# EAGLE design TSOC_MINIPROG_ADAPTER_R1_1 (EAGLE 6.6.0)
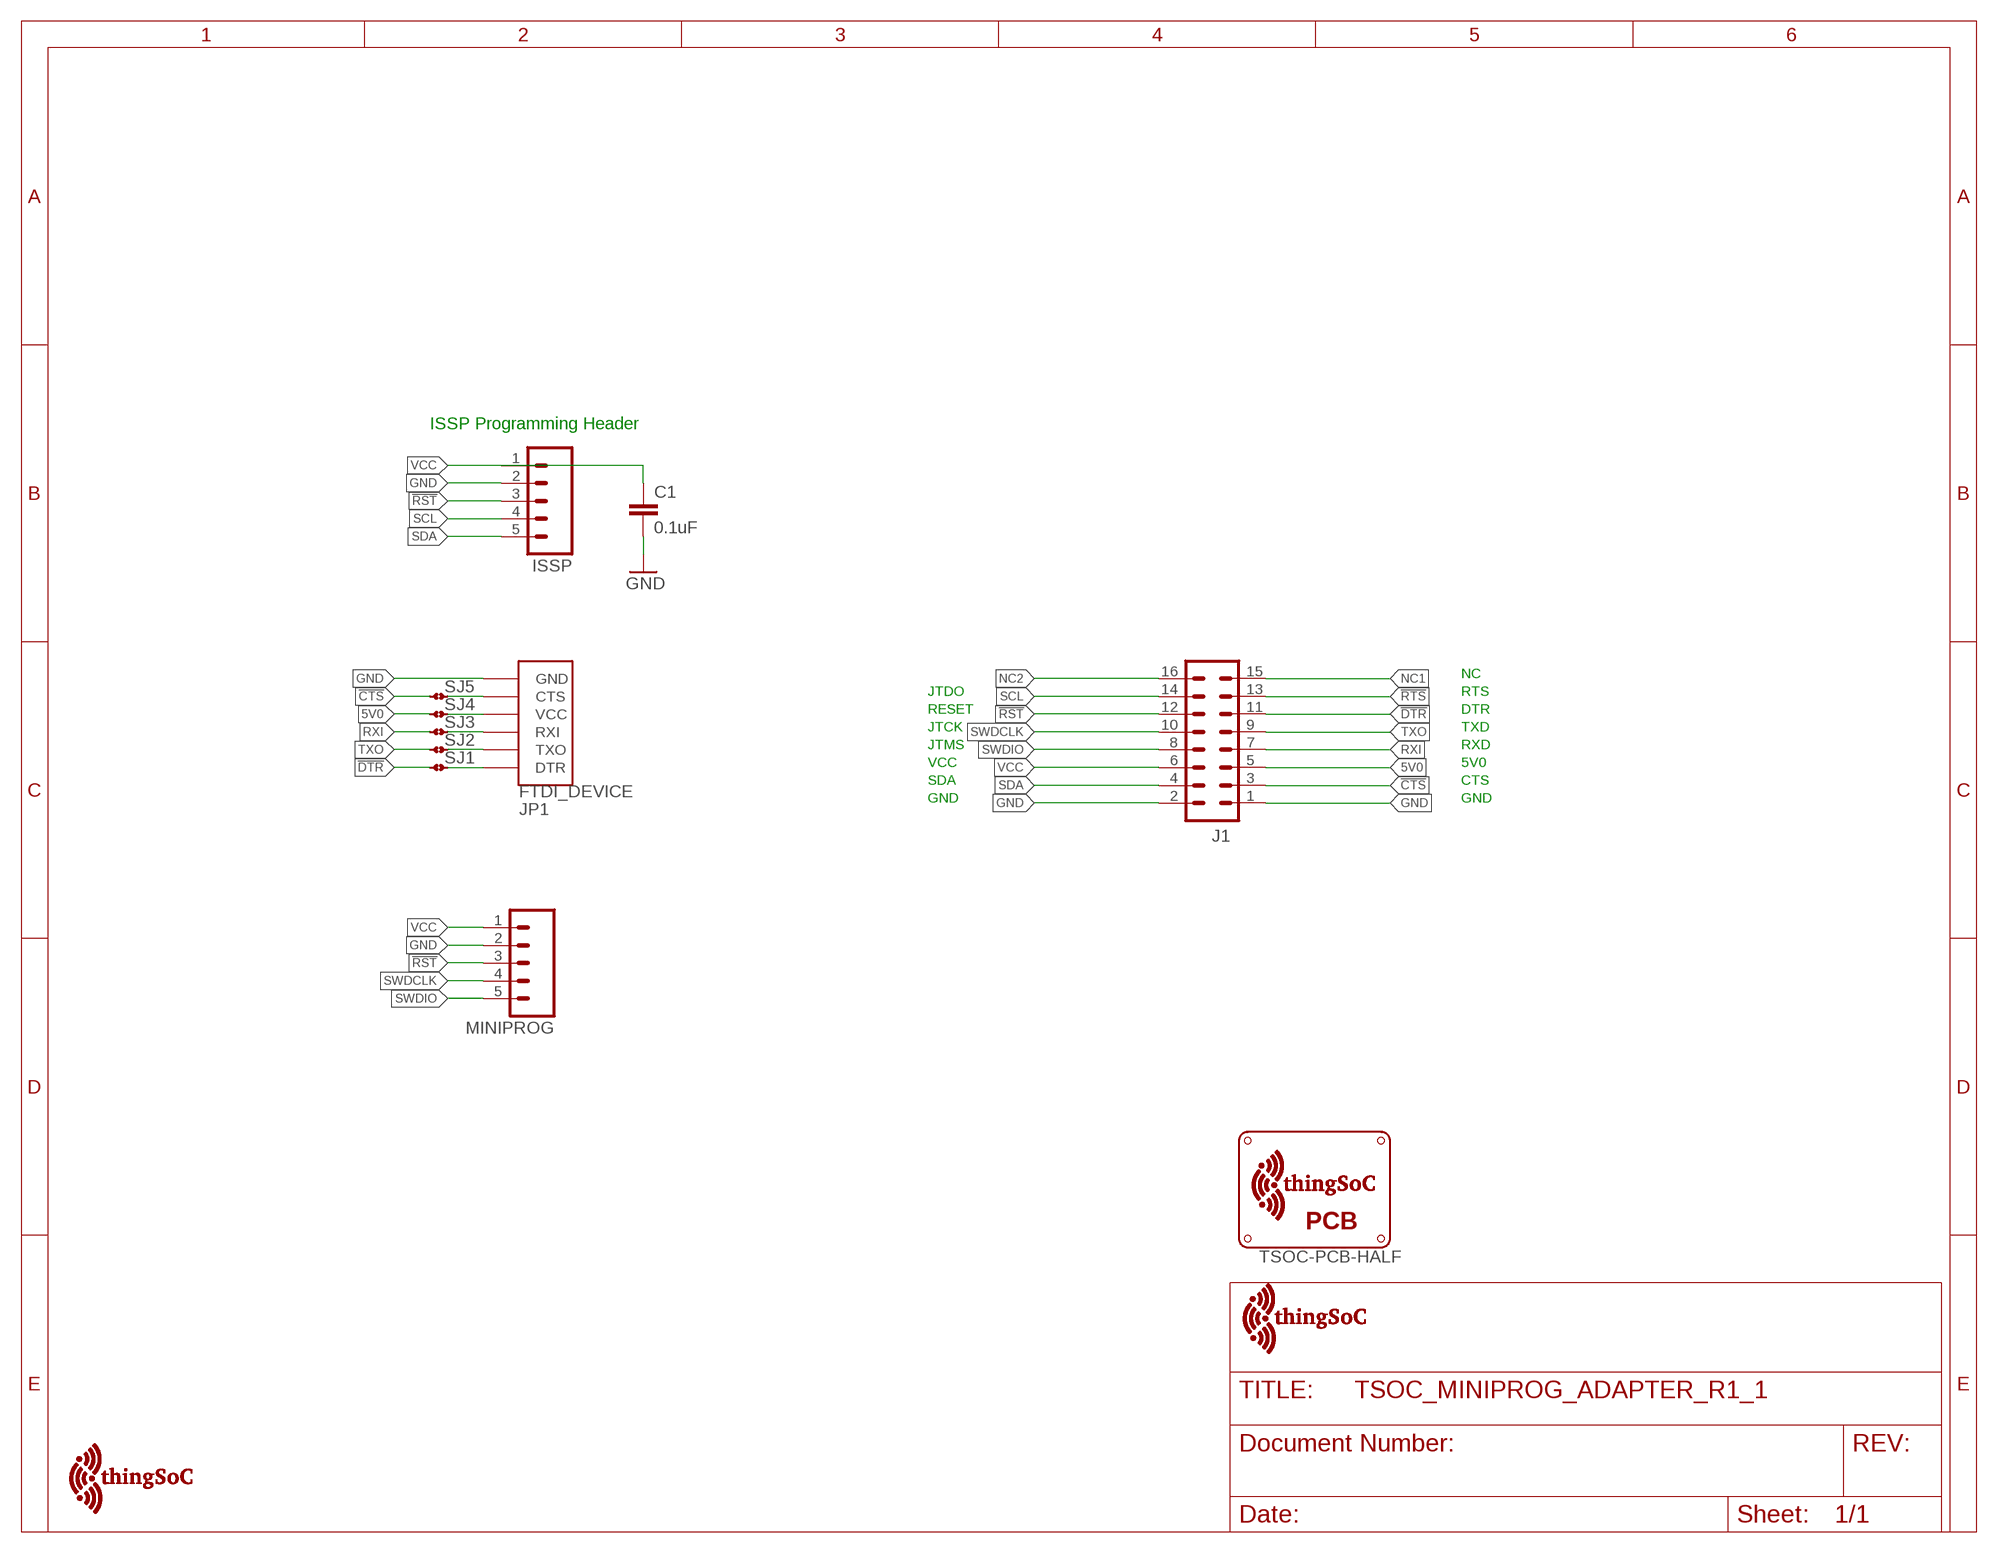
[diagram p0: schematic, sheet 1]

## Parts
C1  0.1uF  CAP0603-CAP  [0603-CAP]
ISSP  M05PTH  [1X05]
J1  M08X2  [2X8]
JP1  FTDI_DEVICE  [FTDI_DEVICE_SIDE]
MINIPROG  M05PTH  [1X05]
SJ1  JMP-2-NO  [JMP-2-NO]
SJ2  JMP-2-NO  [JMP-2-NO]
SJ3  JMP-2-NO  [JMP-2-NO]
SJ4  JMP-2-NO  [JMP-2-NO]
SJ5  JMP-2-NO  [JMP-2-NO]
U$3  TSOC-LOGO-SMALL  [TSOC-LOGO-SML]
U$4  TSOC-PCB-HALF  [TSOC-BB-BRD-HALF]
U$5  TSOC-LOGO-SMALL  [TSOC-LOGO-SML]
U$6  TSOC-LOGO-LRG  [TSOC-LOGO-LRG]

## Nets
5V0: J1.5 SJ4.1
!CTS: J1.3 SJ5.1
!DTR: J1.11 SJ1.1
!RST: ISSP.3 J1.12 MINIPROG.3
!RTS: J1.13
FVCC: JP1.P$4(VCC) SJ4.2
GND: C1.2 ISSP.2 J1.1 J1.2 JP1.P$6(GND) MINIPROG.2
N$1: JP1.P$1(DTR) SJ1.2
N$2: JP1.P$5(CTS) SJ5.2
N$3: JP1.P$3(RXI) SJ3.2
N$4: JP1.P$2(TXO) SJ2.2
NC1: J1.15
NC2: J1.16
RXI: J1.7 SJ3.1
SCL: ISSP.4 J1.14
SDA: ISSP.5 J1.4
SWDCLK: J1.10 MINIPROG.4
SWDIO: J1.8 MINIPROG.5
TXO: J1.9 SJ2.1
VCC: C1.1 ISSP.1 J1.6 MINIPROG.1

## Notes on the sheet
- ISSP Programming Header
- NC
- JTDO | RTS
- RESET | DTR
- JTCK | TXD
- JTMS | RXD
- VCC | 5V0
- SDA | CTS
- GND | GND

## Library data of the parts
C1 = SparkFun:CAP: Capacitor Standard 0603 ceramic capacitor, and 0.1" leaded capacitor.
ISSP = SparkFun:M05: Header 5 Standard 5-pin 0.1" header. Use with straight break away headers (SKU : PRT-00116), right angle break away headers (PRT-00553), swiss pins (PRT-00743), machine pins (PRT-00117), and female headers (PRT-00115). Molex polarized connector foot print use with SKU : PRT-08230 with associated crimp pins and housings.
J1 = TSOC_KITPROG_ADAPTER:M08X2: .1" headers, two rows of 8 each
JP1 = SparkFun-Connectors:FTDI_DEVICE: Connector which mates to FTDI basic or FTDI cable.
MINIPROG = SparkFun-Connectors:M05: Header 5 Standard 5-pin 0.1" header. Use with straight break away headers (SKU : PRT-00116), right angle break away headers (PRT-00553), swiss pins (PRT-00743), machine pins (PRT-00117), and female headers (PRT-00115). Molex polarized connector foot print use with SKU : PRT-08230 with associated crimp pins and housings.
SJ1-SJ5 = PatternAgents-ProtoPads:JMP-2-NO: Two Terminal Jumper - Normally Open Positions 1 and 2 are normally NOT connected. PatternAgents ProtoPads Library Schematic and PCB layout libraries for design patterns by PatternAgents. For the CADSoft Eagle CAD program : http://www.cadsoftusa.com/download-eagle/ Source LBR : http://www.patternagents.com Github : https://github.com/PatternAgents License : http://creativecommons.org/licenses/by-sa/4.0/ (Creative Commons 4.0) THIS SOFTWARE IS PROVIDED BY THE CONTRIBUTORS "AS IS" AND WITHOUT ANY EXPRESS OR IMPLIED WARRANTIES, INCLUDING, BUT NOT LIMITED TO, THE IMPLIED WARRANTIES OF MERCHANTABILITY AND FITNESS FOR A PARTICULAR PURPOSE ARE DISCLAIMED. IN NO EVENT SHALL THE COPYRIGHT OWNER OR CONTRIBUTORS BE LIABLE FOR ANY DIRECT, INDIRECT, INCIDENTAL, SPECIAL, EXEMPLARY, OR CONSEQUENTIAL DAMAGES (INCLUDING, BUT NOT LIMITED TO, PROCUREMENT OF SUBSTITUTE GOODS OR SERVICES; LOSS OF USE, DATA, OR PROFITS; OR BUSINESS INTERRUPTION) HOWEVER CAUSED AND ON ANY THEORY OF LIABILITY, WHETHER IN CONTRACT, STRICT LIABILITY, OR TORT (INCLUDING NEGLIGENCE OR OTHERWISE) ARISING IN ANY WAY OUT OF THE USE OF THIS SOFTWARE, EVEN IF ADVISED OF THE POSSIBILITY OF SUCH DAMAGE.; BOM: EXCLUDE
U$3 U$5 U$6 = thingSoC:TSOC-LOGO: thingSoC Logo Source LBR : http://www.thingsoc.com Github : https://github.com/thingsoc License : http://creativecommons.org/licenses/by-sa/4.0/ (Creative Commons 4.0) THIS SOFTWARE IS PROVIDED BY THE CONTRIBUTORS "AS IS" AND WITHOUT ANY EXPRESS OR IMPLIED WARRANTIES, INCLUDING, BUT NOT LIMITED TO, THE IMPLIED WARRANTIES OF MERCHANTABILITY AND FITNESS FOR A PARTICULAR PURPOSE ARE DISCLAIMED. IN NO EVENT SHALL THE COPYRIGHT OWNER OR CONTRIBUTORS BE LIABLE FOR ANY DIRECT, INDIRECT, INCIDENTAL, SPECIAL, EXEMPLARY, OR CONSEQUENTIAL DAMAGES (INCLUDING, BUT NOT LIMITED TO, PROCUREMENT OF SUBSTITUTE GOODS OR SERVICES; LOSS OF USE, DATA, OR PROFITS; OR BUSINESS INTERRUPTION) HOWEVER CAUSED AND ON ANY THEORY OF LIABILITY, WHETHER IN CONTRACT, STRICT LIABILITY, OR TORT (INCLUDING NEGLIGENCE OR OTHERWISE) ARISING IN ANY WAY OUT OF THE USE OF THIS SOFTWARE, EVEN IF ADVISED OF THE POSSIBILITY OF SUCH DAMAGE.
U$4 = thingSoC:TSOC-PCB: thingSoC PCB Outlines Boards Outlines for Standard Sizes (in the DImension Layer) (Registration marks in the tDocu layer - make sure to turn on tDocu/bDocu) Source LBR : http://www.thingsoc.com Github : https://github.com/thingsoc License : http://creativecommons.org/licenses/by-sa/4.0/ (Creative Commons 4.0) THIS SOFTWARE IS PROVIDED BY THE CONTRIBUTORS "AS IS" AND WITHOUT ANY EXPRESS OR IMPLIED WARRANTIES, INCLUDING, BUT NOT LIMITED TO, THE IMPLIED WARRANTIES OF MERCHANTABILITY AND FITNESS FOR A PARTICULAR PURPOSE ARE DISCLAIMED. IN NO EVENT SHALL THE COPYRIGHT OWNER OR CONTRIBUTORS BE LIABLE FOR ANY DIRECT, INDIRECT, INCIDENTAL, SPECIAL, EXEMPLARY, OR CONSEQUENTIAL DAMAGES (INCLUDING, BUT NOT LIMITED TO, PROCUREMENT OF SUBSTITUTE GOODS OR SERVICES; LOSS OF USE, DATA, OR PROFITS; OR BUSINESS INTERRUPTION) HOWEVER CAUSED AND ON ANY THEORY OF LIABILITY, WHETHER IN CONTRACT, STRICT LIABILITY, OR TORT (INCLUDING NEGLIGENCE OR OTHERWISE) ARISING IN ANY WAY OUT OF THE USE OF THIS SOFTWARE, EVEN IF ADVISED OF THE POSSIBILITY OF SUCH DAMAGE.

## Board
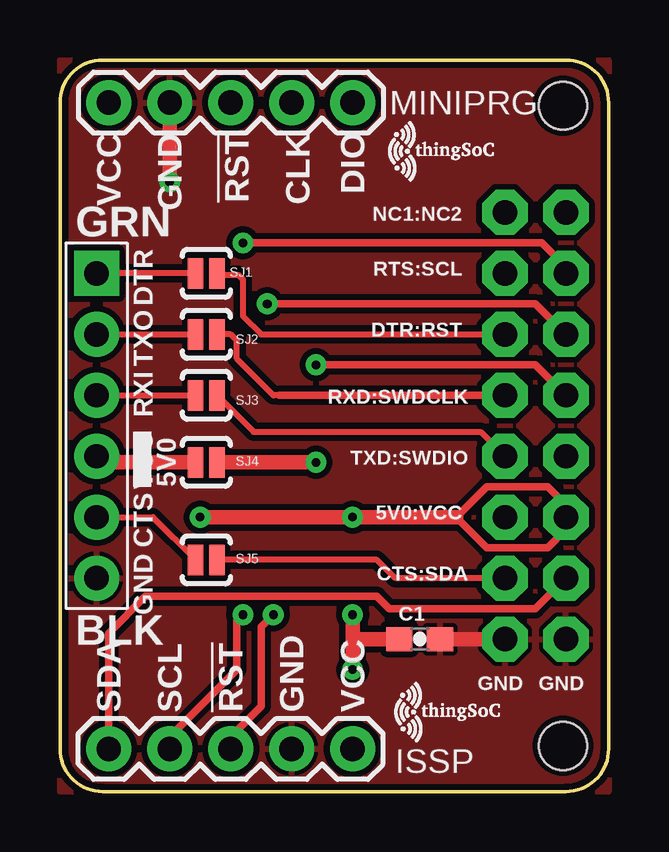
[diagram p1: board, top side]
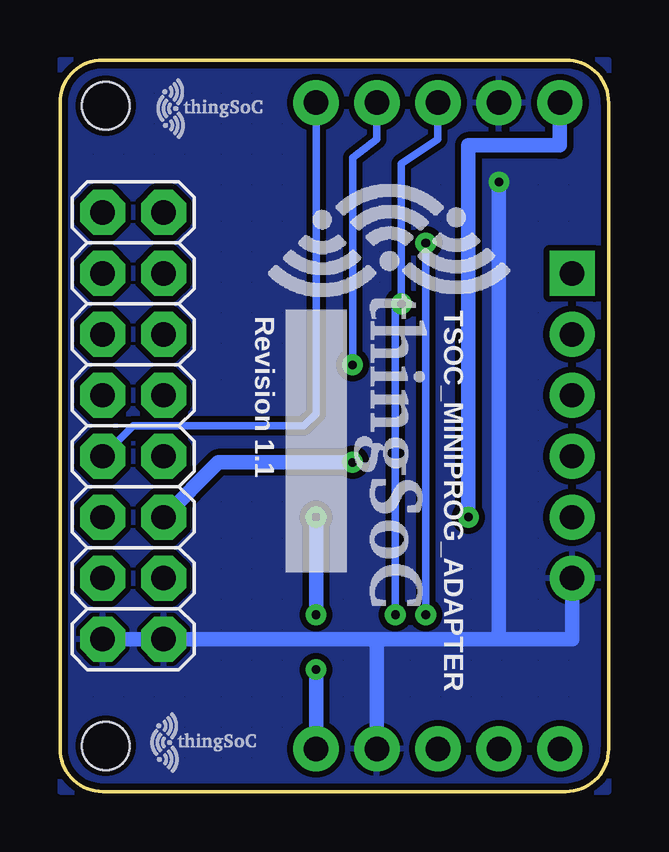
[diagram p2: board, bottom side, seen from below]

Size 22.86 x 30.48 mm. Coordinates in mm from the lower left corner, seen from the top.
Copper layers (1*16): Top 0.035mm / dielectric 1.5mm / Bottom 0.035mm
Design rules "PatternAgents_7mil": minimum track width 7mil, minimum drill 14mil, track to track 7mil, track to pad 7mil, pad to pad 7mil, via to via 7mil, smd to smd 7mil, copper to edge 7mil, drill to drill 7mil, minimum pad ring 12mil, minimum via ring 10mil, stop-mask expansion 4mil, vias tented up to drill 25mil, thermal gap 7mil

### Footprints (pad centres in the part's own frame; a part is rotated, then mirrored left to right if it is on the bottom)
0603-CAP = smd 1.1 x 1: 1 -0.85,0; 2 0.85,0
1X05 = drill 1.016 pad 1.88: 1 0,0; 2 2.54,0; 3 5.08,0; 4 7.62,0; 5 10.16,0
2X8 = drill 1.016 pad 1.88 octagon: 1 0,0; 2 0,2.54; 3 2.54,0; 4 2.54,2.54; 5 5.08,0; 6 5.08,2.54; 7 7.62,0; 8 7.62,2.54; 9 10.16,0; 10 10.16,2.54; 11 12.7,0; 12 12.7,2.54; 13 15.24,0; 14 15.24,2.54; 15 17.78,0; 16 17.78,2.54
FTDI_DEVICE_SIDE = drill 1.016 pad 1.88 square: P$1 -6.35,0 | drill 1.016 pad 1.88: P$2 -3.81,0; P$3 -1.27,0; P$4 1.27,0; P$5 3.81,0; P$6 6.35,0
JMP-2-NO = smd 0.635 x 1.27: 1 -0.45,0; 2 0.45,0
TSOC-BB-BRD-HALF = hole 2: 1.905,1.905; 28.575,1.905

### Placement (x,y rotation side)
C1  14.99,6.35 0 top
ISSP  12.19,1.78 180 top
J1  18.54,6.35 90 bottom
JP1  1.52,15.24 270 top
MINIPROG  2.03,28.7 0 top
SJ1  6.1,21.59 180 top
SJ2  6.1,19.05 180 top
SJ3  6.1,16.51 180 top
SJ4  6.1,13.72 180 top
SJ5  6.1,9.65 180 top
U$1  TSOC-LOGO-SMALL  [TSOC-LOGO-SML]  14.48,26.67 0 top
U$2  TSOC-LOGO-SMALL  [TSOC-LOGO-SML]  18.03,28.45 0 bottom
U$3  14.73,3.3 0 top
U$4  22.86,0 90 top
U$5  18.29,2.03 0 bottom
U$6  9.14,22.1 270 bottom

### Tracks (layer width: path | path; a pad name or v marks a point on that pad's centre or on a via)
5V0  (via drill 0.36)
  Top 0.61: SJ4.1 v10.67,13.72
  Bottom 0.61: v10.67,13.72 16.26,13.72 J1.5
!CTS
  Top 0.254: J1.3 13.97,8.89 13.21,9.65 SJ5.1
!DTR
  Top 0.254: J1.11 8.38,19.05 7.62,19.81 7.62,21.34 7.42,21.53 6.6,21.53 SJ1.1
!RST  (via drill 0.36)
  Top 0.305: v8.64,20.32 19.81,20.32 J1.12 | ISSP.3 7.11,2.29 8.38,3.56 8.38,6.86 v8.89,7.37
  Bottom 0.305: MINIPROG.3 7.11,27.18 8.64,26.16 v8.64,20.32 8.89,20.07 v8.89,7.37
FVCC
  Top 0.61: SJ4.2 1.78,13.72 JP1.P$4
GND  (via drill 0.36)
  Top 0.61: C1.2 J1.1 | MINIPROG.2 v4.57,25.4
  Bottom 0.61: J1.2 J1.1 9.65,6.35 | 9.65,6.35 ISSP.2 | v4.57,25.4 4.57,6.35 | 4.57,6.35 9.65,6.35 | JP1.P$6 1.52,6.35 4.57,6.35
  pour Top (isolate 0.254, hatched): 0,0 0,30.48 22.86,30.48 22.86,0
  pour Bottom (isolate 0.254, hatched): 0,0 0,30.48 22.86,30.48 22.86,0
N$1
  Top 0.254: SJ1.2 JP1.P$1
N$2
  Top 0.254: JP1.P$5 3.87,11.43 SJ5.2
N$3
  Top 0.254: JP1.P$3 SJ3.2
N$4
  Top 0.254: JP1.P$2 SJ2.2
RXI
  Top 0.254: J1.7 17.53,14.99 8.07,14.99 SJ3.1
SCL  (via drill 0.36)
  Top 0.305: J1.14 21.08,21.84 20.07,22.86 v7.62,22.86 | ISSP.4 4.57,2.29 7.37,5.08 7.37,7.11 v7.62,7.37
  Bottom 0.305: v7.62,7.37 v7.62,22.86
SDA
  Top 0.305: J1.4 19.81,7.62 13.72,7.62 13.21,8.13 3.56,8.13 2.03,6.6 ISSP.5
SWDCLK  (via drill 0.36)
  Top 0.305: v10.67,17.78 19.81,17.78 J1.10
  Bottom 0.305: MINIPROG.4 9.65,27.18 10.67,26.42 v10.67,17.78
SWDIO
  Bottom 0.305: MINIPROG.5 12.19,15.75 12.7,15.24 19.81,15.24 J1.8
TXO
  Top 0.254: 9.14,16.51 8.89,16.51 7.37,18.03 7.37,18.8 7.11,19.05 SJ2.1
  Top 0.305: J1.9 9.14,16.51
VCC  (via drill 0.36)
  Top 0.305: J1.6 21.08,11.94 20.32,12.7 17.78,12.7 16.51,11.43 17.78,10.16 20.32,10.16 21.08,10.92 J1.6
  Top 0.61: v12.19,5.08 12.19,6.1 | 12.19,6.1 v12.19,7.37 | C1.1 12.45,6.35 12.19,6.1 | v5.84,11.43 v12.19,11.43 16.51,11.43
  Bottom 0.61: MINIPROG.1 2.03,26.92 5.84,26.92 v5.84,11.43 | ISSP.1 v12.19,5.08 | v12.19,7.37 v12.19,11.43

### Text on the board
tPlace: MINIPRG | VCC | GND | !RST | CLK | DIO | NC1:NC2 | RTS:SCL | DTR:RST | RXD:SWDCLK | TXD:SWDIO | 5V0 | 5V0:VCC | CTS:SDA | GND | GND | SDA | SCL | !RST | GND | VCC | ISSP
bPlace: TSOC_MINIPROG_ADAPTER | Revision 1.1